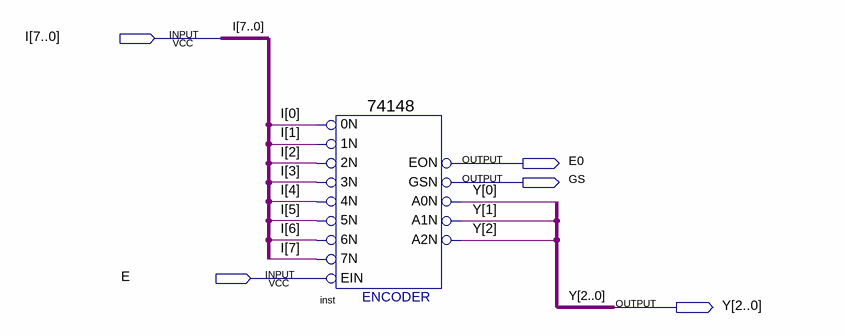
[diagram p0: schematic sheet]
// Quartus schematic Block4.bdf as structural Verilog: 1 symbols, 5 pins
module Block4 (
  input  [7:0] I,
  input  E,
  output E0,
  output GS,
  output [2:0] Y
);

  \74148  inst (
    .\5N (I[5]), .\0N (I[0]), .\1N (I[1]), .\2N (I[2]), .\3N (I[3]), .\4N (I[4]), .EIN(E), .\6N (I[6]),
    .\7N (I[7]), .A1N(Y[1]), .A0N(Y[0]), .A2N(Y[2]), .EON(E0), .GSN(GS));
endmodule
